# EAGLE design kleppen (EAGLE 7.2.0)
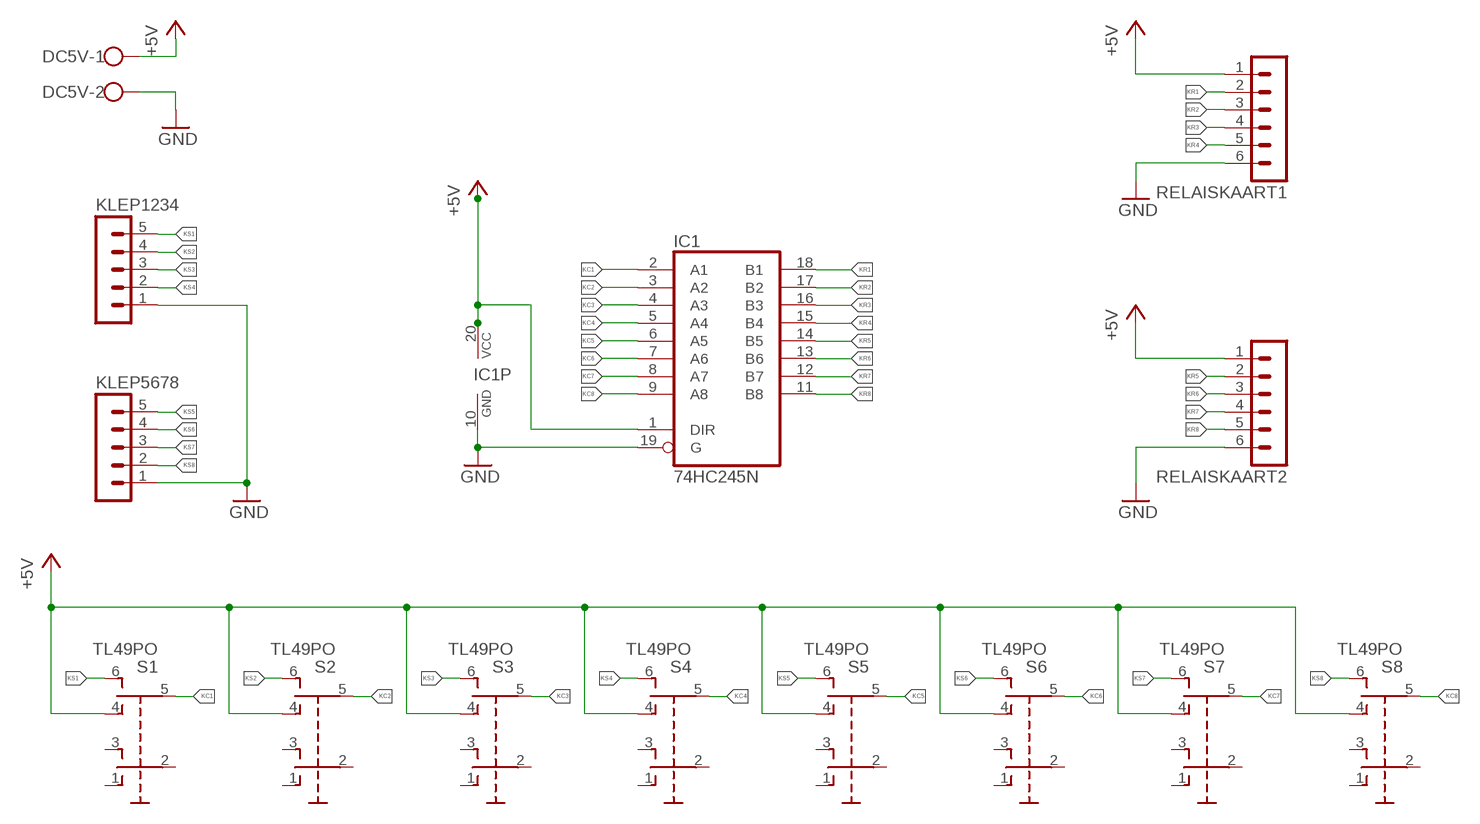
[diagram p0: schematic, sheet 1]

## Parts
DC5V  W237-102  [W237-102]
IC1  74HC245N  [DIL20]
KLEP1234  MA05-1  [MA05-1]
KLEP5678  MA05-1  [MA05-1]
RELAISKAART1  MA06-1  [MA06-1]
RELAISKAART2  MA06-1  [MA06-1]
S1  TL49PO  [TL4XPO]
S2  TL49PO  [TL4XPO]
S3  TL49PO  [TL4XPO]
S4  TL49PO  [TL4XPO]
S5  TL49PO  [TL4XPO]
S6  TL49PO  [TL4XPO]
S7  TL49PO  [TL4XPO]
S8  TL49PO  [TL4XPO]

## Nets
+5V: DC5V.1 IC1.1(DIR) IC1.20(VCC) RELAISKAART1.1 RELAISKAART2.1 S1.4(O1) S2.4(O1) S3.4(O1) S4.4(O1) S5.4(O1) S6.4(O1) S7.4(O1) S8.4(O1)
GND: DC5V.2 IC1.10(GND) IC1.19(G) RELAISKAART1.6 RELAISKAART2.6
KC1: IC1.2(A1) S1.5(P1)
KC2: IC1.3(A2) S2.5(P1)
KC3: IC1.4(A3) S3.5(P1)
KC4: IC1.5(A4) S4.5(P1)
KC5: IC1.6(A5) S5.5(P1)
KC6: IC1.7(A6) S6.5(P1)
KC7: IC1.8(A7) S7.5(P1)
KC8: IC1.9(A8) S8.5(P1)
KR1: IC1.18(B1) RELAISKAART1.2
KR2: IC1.17(B2) RELAISKAART1.3
KR3: IC1.16(B3) RELAISKAART1.4
KR4: IC1.15(B4) RELAISKAART1.5
KR5: IC1.14(B5) RELAISKAART2.2
KR6: IC1.13(B6) RELAISKAART2.3
KR7: IC1.12(B7) RELAISKAART2.4
KR8: IC1.11(B8) RELAISKAART2.5
KS1: KLEP1234.5 S1.6(S1)
KS2: KLEP1234.4 S2.6(S1)
KS3: KLEP1234.3 S3.6(S1)
KS4: KLEP1234.2 S4.6(S1)
KS5: KLEP5678.5 S5.6(S1)
KS6: KLEP5678.4 S6.6(S1)
KS7: KLEP5678.3 S7.6(S1)
KS8: KLEP1234.1 KLEP5678.1 KLEP5678.2 S8.6(S1) ; supply symbol labelled GND
Unconnected: S1.1(O) S1.2(P) S1.3(S) S2.1(O) S2.2(P) S2.3(S) S3.1(O) S3.2(P) S3.3(S) S4.1(O) S4.2(P) S4.3(S) S5.1(O) S5.2(P) S5.3(S) S6.1(O) S6.2(P) S6.3(S) S7.1(O) S7.2(P) S7.3(S) S8.1(O) S8.2(P) S8.3(S)

## Library data of the parts
DC5V = con-wago-500:W237-102: WAGO SCREW CLAMP; MPN: 237-102; OC_FARNELL: unknown; OC_NEWARK: 70K9898
IC1 = 74xx-eu:74*245: Octal BUS TRANSCEIVER, 3-state
KLEP1234 KLEP5678 = con-lstb:MA05-1: PIN HEADER; OC_FARNELL: unknown; OC_NEWARK: unknown
RELAISKAART1 RELAISKAART2 = con-lstb:MA06-1: PIN HEADER; OC_FARNELL: unknown; OC_NEWARK: unknown
S1-S8 = switch:TL49PO: TINY SWITCH ON OFF ON Source: http://www2.produktinfo.conrad.com/datenblaetter/700000-724999/705152-da-01-de-Subminiaturschalter_TL_36YO.pdf

## Board
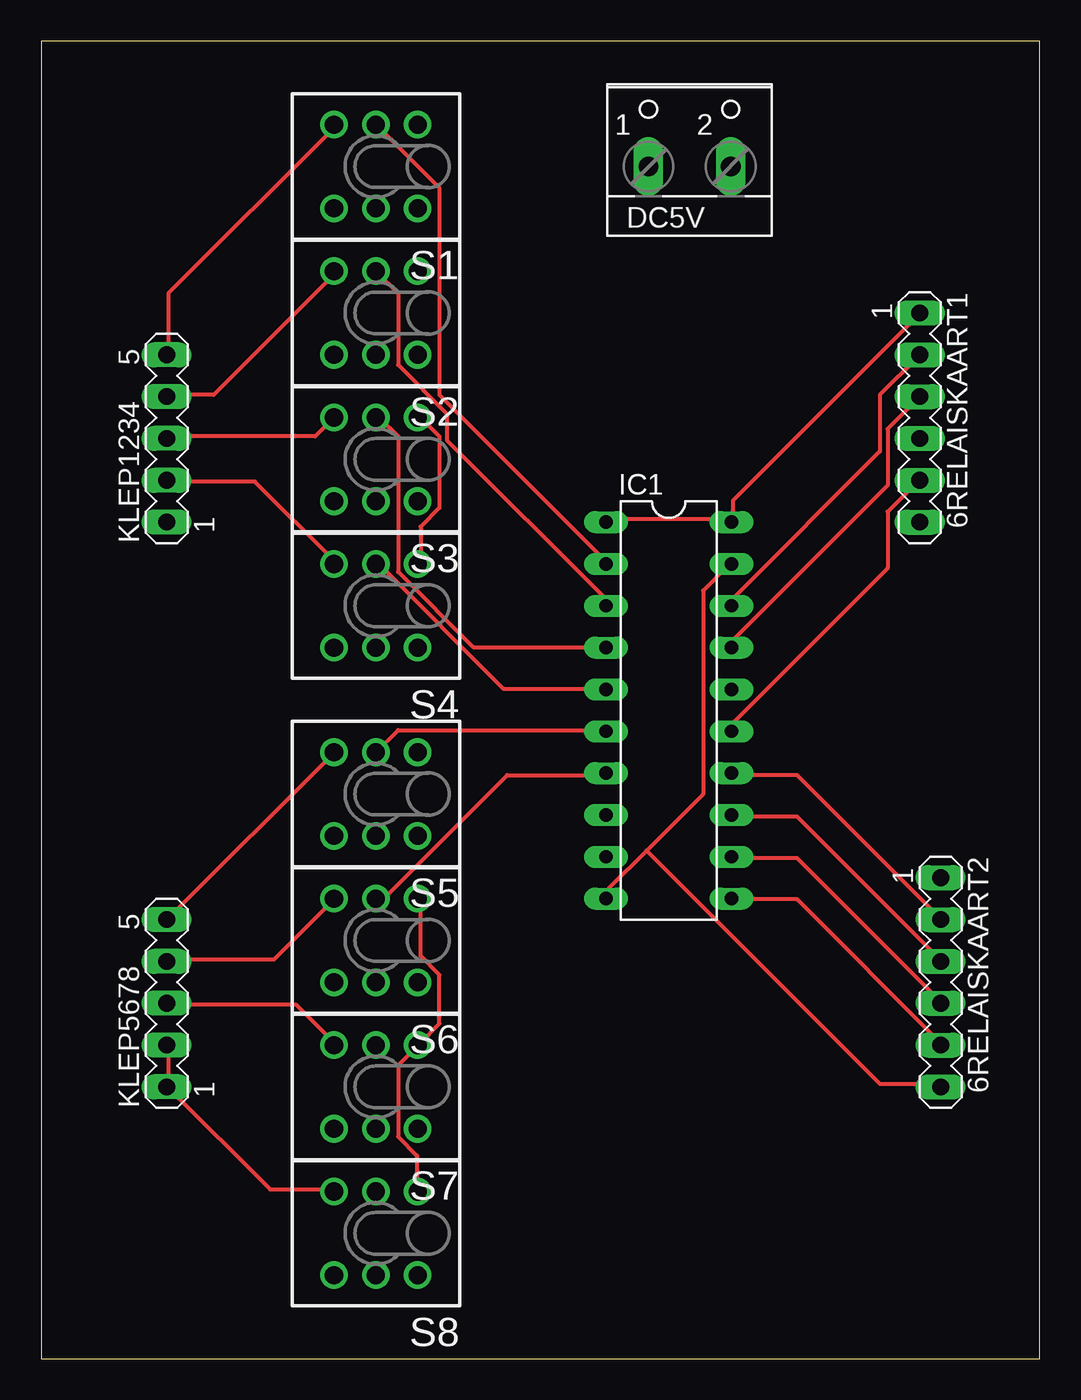
[diagram p1: board, top side]
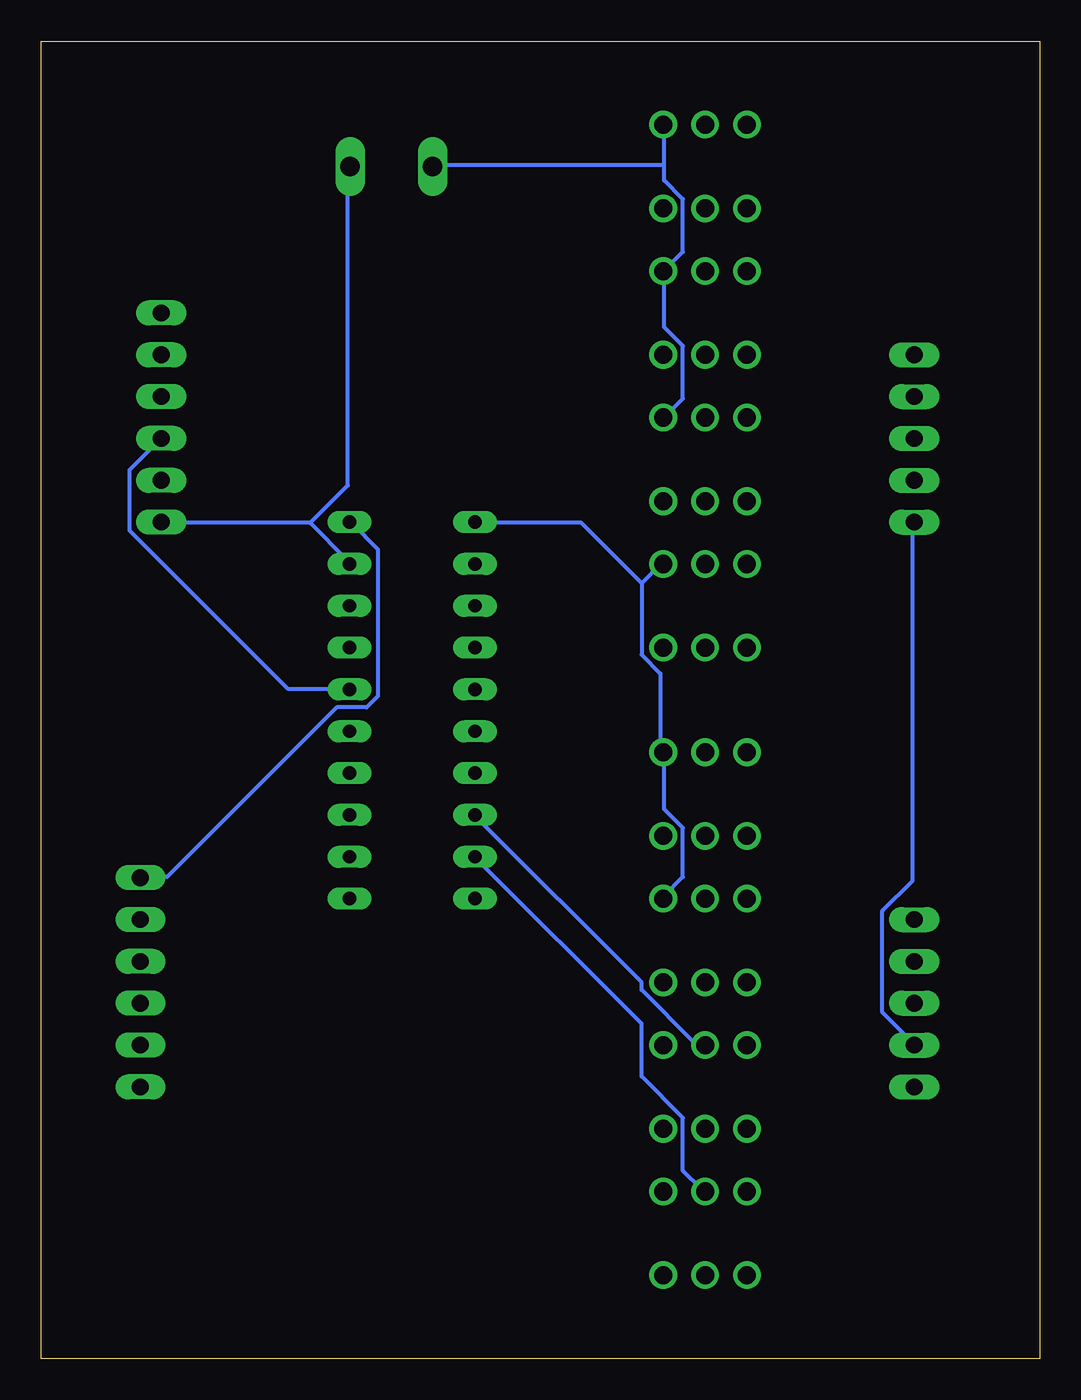
[diagram p2: board, bottom side, seen from below]

Size 60.63 x 80 mm. Coordinates in mm from the lower left corner, seen from the top.
Outline: 0,0 60.63,0 60.63,80 0,80 0,0
Copper layers (1*16): Top 0.035mm / dielectric 1.5mm / Bottom 0.035mm
Design rules "default": minimum track width 10mil, minimum drill 24mil, track to track 8mil, track to pad 8mil, pad to pad 8mil, via to via 8mil, smd to smd 8mil, copper to edge 40mil, drill to drill 8mil, minimum pad ring 10mil, minimum via ring 8mil, stop-mask expansion 4mil, vias tented up to drill 0mil, thermal gap 10mil

### Footprints (pad centres in the part's own frame; a part is rotated, then mirrored left to right if it is on the bottom)
W237-102 = drill 1.194 long: 1 -2.5,-1.27; 2 2.5,-1.27
DIL20 = drill 0.813 long: 1 -11.43,-3.81; 2 -8.89,-3.81; 3 -6.35,-3.81; 4 -3.81,-3.81; 5 -1.27,-3.81; 6 1.27,-3.81; 7 3.81,-3.81; 8 6.35,-3.81; 9 8.89,-3.81; 10 11.43,-3.81; 11 11.43,3.81; 12 8.89,3.81; 13 6.35,3.81; 14 3.81,3.81; 15 1.27,3.81; 16 -1.27,3.81; 17 -3.81,3.81; 18 -6.35,3.81; 19 -8.89,3.81; 20 -11.43,3.81
MA05-1 = drill 1.016 long: 1 -5.08,0; 2 -2.54,0; 3 0,0; 4 2.54,0; 5 5.08,0
MA06-1 = drill 1.016 long: 1 -6.35,0; 2 -3.81,0; 3 -1.27,0; 4 1.27,0; 5 3.81,0; 6 6.35,0
TL4XPO = drill 1.1 pad 1.676: 1 -2.54,2.54; 2 0,2.54; 3 2.54,2.54; 4 -2.54,-2.54; 5 0,-2.54; 6 2.54,-2.54

### Placement (x,y rotation side)
DC5V  39.37,73.66 0 top
IC1  38.1,39.37 270 top
KLEP1234  7.62,55.88 90 top
KLEP5678  7.62,21.59 90 top
RELAISKAART1  53.34,57.15 270 top
RELAISKAART2  54.61,22.86 270 top
S1  20.32,72.39 180 top
S2  20.32,63.5 180 top
S3  20.32,54.61 180 top
S4  20.32,45.72 180 top
S5  20.32,34.29 180 top
S6  20.32,25.4 180 top
S7  20.32,16.51 180 top
S8  20.32,7.62 180 top

### Tracks (layer width: path | path; a pad name or v marks a point on that pad's centre or on a via)
+5V
  Top 0.254: IC1.1 34.47,50.98 41.78,50.98 IC1.20 42.01,50.98 42.01,52.12 53.21,63.32 RELAISKAART1.1 | S8.4 22.81,10.29 22.81,12.34 21.67,13.49 21.67,17.83 22.81,18.97 S7.4 23.04,19.2 24.18,20.34 24.18,23.32 23.04,24.46 23.04,27.89 S6.4 | S4.4 23.04,48.46 23.04,50.52 24.18,51.66 24.18,56.01 23.04,57.15 S3.4
  Bottom 0.254: RELAISKAART2.1 54.58,29.26 52.98,29.26 42.7,39.55 40.87,39.55 40.18,40.23 40.18,49.15 41.78,50.75 IC1.20 | S6.4 22.81,28.12 21.67,29.26 21.67,32.23 22.81,33.38 22.81,36.8 S5.4 23.04,37.03 23.04,41.6 24.18,42.75 24.18,47.09 | S3.4 22.81,57.15 21.67,58.29 21.67,61.49 22.81,62.64 22.81,65.84 S2.4 22.81,66.06 21.67,67.21 21.67,70.41 22.81,71.55 22.81,72.47 | 22.81,72.47 22.81,74.75 S1.4 | 22.81,72.47 36.75,72.47 DC5V.1 | 24.18,47.09 23.04,48.23 S4.4 | 24.18,47.09 27.84,50.75 34.24,50.75 IC1.1
GND
  Top 0.254: 36.75,30.86 40.18,34.29 40.18,46.63 41.78,48.23 IC1.19 | 36.75,30.86 34.47,28.57 34.47,28.12 IC1.10 | 36.75,30.86 50.93,16.69 54.58,16.69 RELAISKAART2.6
  Bottom 0.254: 44.3,50.75 53.21,50.75 RELAISKAART1.6 | 44.3,50.75 42.01,48.46 IC1.19 | 44.3,50.75 42.01,53.03 42.01,72.24 DC5V.2
KC1
  Top 0.254: IC1.2 34.24,48.46 24.18,58.52 24.18,71.09 20.52,74.75 S1.5
KC2
  Top 0.254: S2.5 21.67,64.69 21.67,60.35 24.64,57.38 24.64,55.78 34.24,46.18 34.24,45.72 IC1.3
KC3
  Top 0.254: IC1.4 34.24,43.2 26.24,43.2 21.67,47.78 21.67,56.01 20.52,57.15 S3.5
KC4
  Top 0.254: IC1.5 34.24,40.69 28.07,40.69 20.52,48.23 S4.5
KC5
  Top 0.254: S5.5 21.67,38.18 34.24,38.18 IC1.6
KC6
  Top 0.254: IC1.7 34.24,35.43 28.3,35.43 20.98,28.12 20.52,28.12 S6.5
KC7
  Bottom 0.254: IC1.8 34.24,32.92 24.18,22.86 24.18,22.4 20.98,19.2 20.52,19.2 S7.5
KC8
  Bottom 0.254: IC1.9 34.24,30.4 24.18,20.34 24.18,17.14 21.67,14.63 21.67,11.43 20.52,10.29 S8.5
KR1
  Top 0.254: IC1.18 42.01,45.72 42.01,46.18 50.93,55.09 50.93,58.52 53.21,60.81 RELAISKAART1.2
KR2
  Top 0.254: RELAISKAART1.3 51.38,56.46 51.38,53.03 42.01,43.66 42.01,43.2 IC1.17
KR3
  Bottom 0.254: RELAISKAART1.4 55.27,53.95 55.27,50.29 45.67,40.69 42.01,40.69 IC1.16
KR4
  Top 0.254: IC1.15 42.01,38.18 42.01,38.63 51.38,48.01 51.38,51.44 53.21,53.26 RELAISKAART1.5
KR5
  Top 0.254: IC1.14 42.01,35.43 45.9,35.43 54.58,26.75 RELAISKAART2.2
KR6
  Top 0.254: IC1.13 42.01,32.92 45.9,32.92 54.58,24.23 RELAISKAART2.3
KR7
  Top 0.254: IC1.12 42.01,30.4 45.9,30.4 54.58,21.72 RELAISKAART2.4
KR8
  Top 0.254: IC1.11 42.01,27.89 45.9,27.89 54.58,19.2 RELAISKAART2.5
KS1
  Top 0.254: KLEP1234.5 7.72,61.04 7.72,64.69 17.78,74.75 S1.6
KS2
  Top 0.254: KLEP1234.4 7.72,58.52 10.46,58.52 17.78,65.84 S2.6
KS3
  Top 0.254: S3.6 16.64,56.01 7.72,56.01 KLEP1234.3
KS4
  Top 0.254: KLEP1234.2 7.72,53.26 12.98,53.26 17.78,48.46 S4.6
KS5
  Top 0.254: KLEP5678.5 7.72,26.75 17.78,36.8 S5.6
KS6
  Top 0.254: KLEP5678.4 7.72,24.23 14.12,24.23 17.78,27.89 S6.6
KS7
  Top 0.254: KLEP5678.3 7.72,21.49 15.49,21.49 17.78,19.2 S7.6
KS8
  Top 0.254: KLEP5678.2 7.72,18.97 7.72,16.69 KLEP5678.1 7.72,16.46 13.89,10.29 17.78,10.29 S8.6
  Bottom 0.254: KLEP1234.1 7.72,50.75 7.72,29.03 9.55,27.2 9.55,21.03 7.72,19.2 KLEP5678.2